# Altium project 3xAY_plus_RAM.PrjPCB
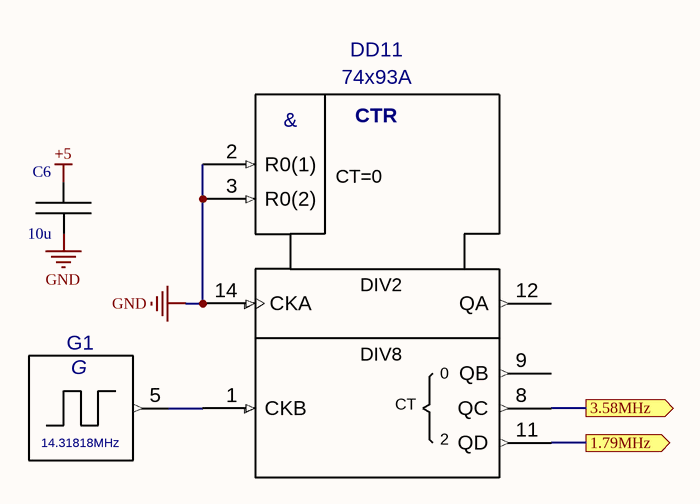
[diagram p0: oscillator.SchDoc]
7 sheets, 108 parts. Net scope: hierarchical (ports join the sheet entries above them; power ports are global).
Board file: main_board.PcbDoc
Sheets:
  oscillator.SchDoc
  main.SchDoc
    AY1 = ay.SchDoc
    AY2 = ay.SchDoc
    AY3 = ay.SchDoc
    Audio Mixer = mixer.SchDoc
    System Bus = system_bus.SchDoc
    Address Detector = address_detector.SchDoc
    Future Connector = future_connector.SchDoc

## Sheet oscillator.SchDoc
size A4

### Parts
(Parts that share a designator on the sheet are numbered #1, #2 ... from top to bottom, then left to right.)
C6#1  10u  [CAP 5.5x3.15]
DD11#1  74x93A  [DIP14]
G1#1  Frequency: 14.31818MHz  [DIP8 CXO]  (hidden comment: CXO)

### Ports
1.79MHz (out), 3.58MHz (out)

### Nets
+5: C6#1.2 DD11#1.5(+5)
GND: C6#1.1 DD11#1.2(R0(1)) DD11#1.3(R0(2)) DD11#1.10(GND) DD11#1.14(CKA)
NetDD11#1_1: DD11#1.1(CKB) G1#1.5
NetDD11#1_8: DD11#1.8(QC) ; port 3.58MHz
NetDD11#1_11: DD11#1.11(QD) ; port 1.79MHz

Not connected (* = marked no-connect by the designer): DD11#1 4(N.C.) 6(N.C.) 7(N.C.) 9(QB) 12(QA) 13(N.C.); G1#1 1(N.C.) 4(GND) 8(+5)

### Notes on the sheet
- (in symbol 74x93A IEEE) CTR; &; CT=0; DIV2; DIV8; 0; CT
- (in symbol CXO) G

### Library data of the parts
C6#1 = Cap: Murata ceramic capacitor
DD11#1 = 74x93A IEEE: ИЕ5; Value: *

## Sheet main.SchDoc
size A4
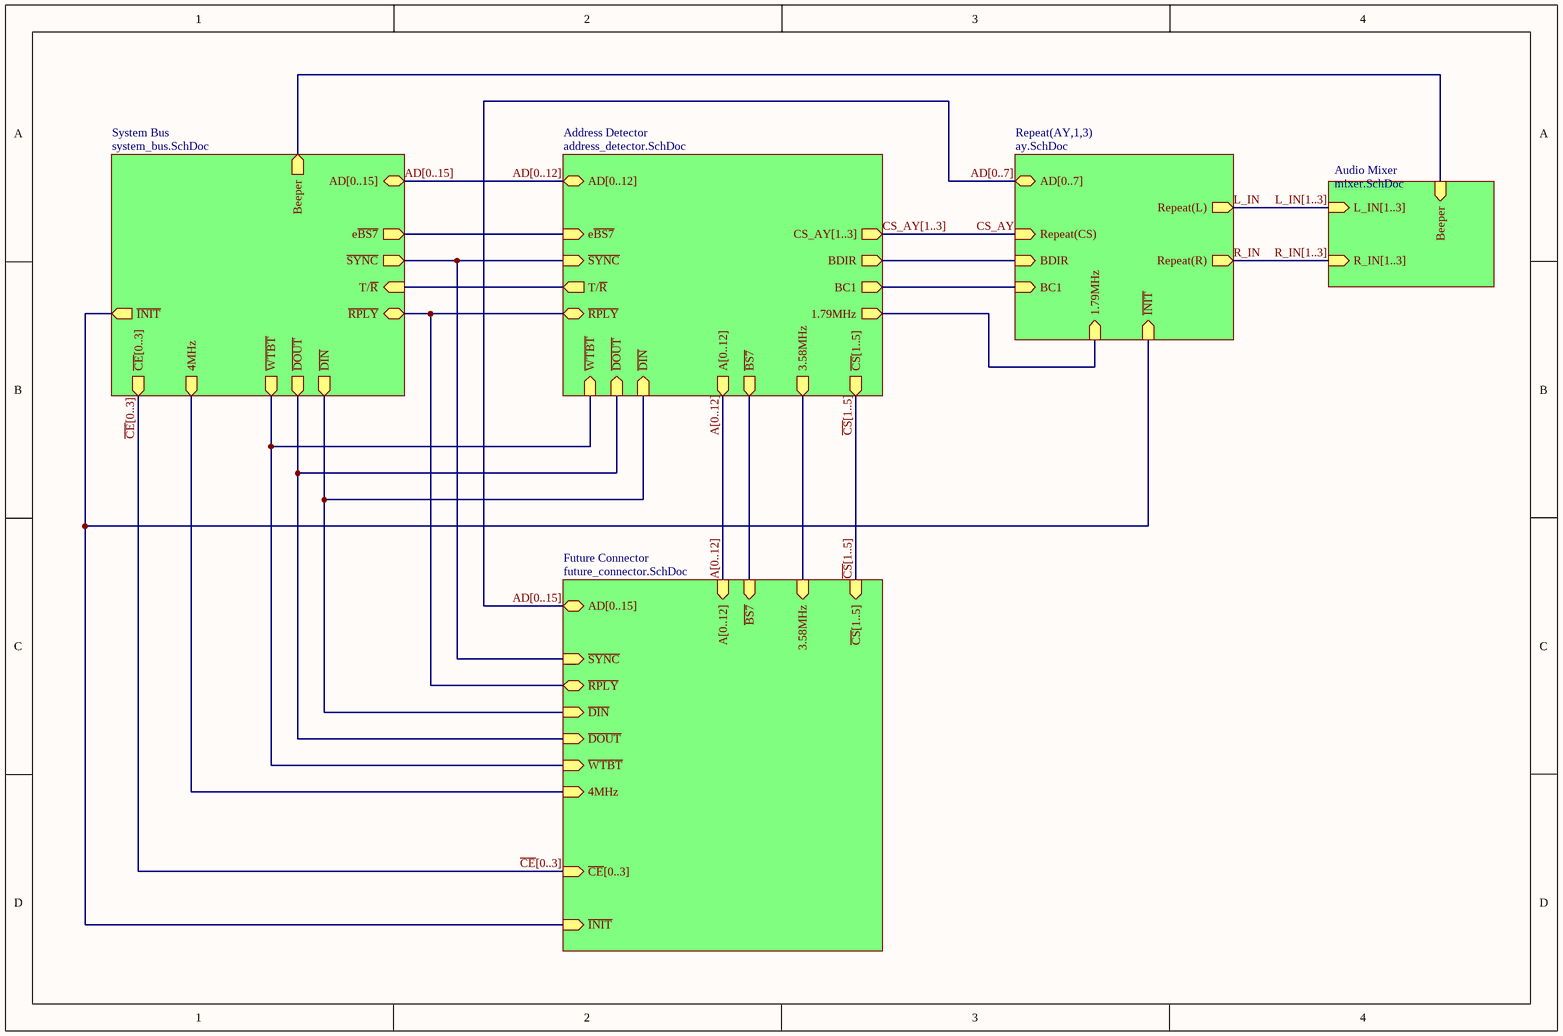
[diagram p1: main.SchDoc]

### Sub-sheets
Address Detector = address_detector.SchDoc: e~{BS7} (in), CS_AY[1..3] (out), AD[0..12] (bidir), ~{SYNC} (in), A[0..12] (out), ~{BS7} (out), ~{CS}[1..5] (out), ~{DOUT} (in), BDIR (out), ~{WTBT} (in), T/~{R} (out), BC1 (out), ~{DIN} (in), ~{RPLY} (bidir), 1.79MHz (out), 3.58MHz (out)
Audio Mixer = mixer.SchDoc: L_IN[1..3] (in), R_IN[1..3] (in), Beeper (in)
Future Connector = future_connector.SchDoc: AD[0..15] (bidir), A[0..12] (in), ~{CS}[1..5] (in), ~{BS7} (in), 3.58MHz (in), ~{DIN} (in), ~{WTBT} (in), ~{CE}[0..3] (in), ~{DOUT} (in), ~{INIT} (in), 4MHz (in), ~{SYNC} (in), ~{RPLY} (bidir)
Repeat(AY,1,3) = ay.SchDoc: Repeat(CS) (in), Repeat(L) (out), ~{INIT} (in), AD[0..7] (bidir), 1.79MHz (in), Repeat(R) (out), BC1 (in), BDIR (in)
System Bus = system_bus.SchDoc: AD[0..15] (bidir), e~{BS7} (out), ~{SYNC} (out), ~{DOUT} (out), ~{DIN} (out), ~{WTBT} (out), ~{INIT} (out), ~{CE}[0..3] (out), T/~{R} (in), ~{RPLY} (bidir), 4MHz (out), Beeper (out)

### Nets
3.58MHz: sheet Address Detector/3.58MHz, sheet Future Connector/3.58MHz
4MHz: sheet System Bus/4MHz, sheet Future Connector/4MHz
~{BS7}: sheet Address Detector/~{BS7}, sheet Future Connector/~{BS7}
BC1: sheet Repeat(AY,1,3)/BC1, sheet Address Detector/BC1
BDIR: sheet Repeat(AY,1,3)/BDIR, sheet Address Detector/BDIR
Beeper: sheet Audio Mixer/Beeper, sheet System Bus/Beeper
CLK: sheet Repeat(AY,1,3)/1.79MHz, sheet Address Detector/1.79MHz
CS_AY: sheet Repeat(AY,1,3)/Repeat(CS)
~{DIN}: sheet System Bus/~{DIN}, sheet Address Detector/~{DIN}, sheet Future Connector/~{DIN}
~{DOUT}: sheet System Bus/~{DOUT}, sheet Address Detector/~{DOUT}, sheet Future Connector/~{DOUT}
e~{BS7}: sheet System Bus/e~{BS7}, sheet Address Detector/e~{BS7}
~{INIT}: sheet Repeat(AY,1,3)/~{INIT}, sheet System Bus/~{INIT}, sheet Future Connector/~{INIT}
L_IN: sheet Repeat(AY,1,3)/Repeat(L)
~{RPLY}: sheet System Bus/~{RPLY}, sheet Address Detector/~{RPLY}, sheet Future Connector/~{RPLY}
R_IN: sheet Repeat(AY,1,3)/Repeat(R)
~{SYNC}: sheet System Bus/~{SYNC}, sheet Address Detector/~{SYNC}, sheet Future Connector/~{SYNC}
T/~{R}: sheet System Bus/T/~{R}, sheet Address Detector/T/~{R}
~{WTBT}: sheet System Bus/~{WTBT}, sheet Address Detector/~{WTBT}, sheet Future Connector/~{WTBT}

### Buses and harness runs
bus A[0..12]
bus A[0..12] = sheet Address Detector/A[0..12] = sheet Future Connector/A[0..12]
bus AD[0..7] = AD[0..12] = AD[0..15] = sheet Address Detector/AD[0..12] = sheet Future Connector/AD[0..15] = sheet Repeat(AY,1,3)/AD[0..7] = sheet System Bus/AD[0..15]
bus CS_AY[1..3] = sheet Address Detector/CS_AY[1..3]
bus L_IN[1..3] = sheet Audio Mixer/L_IN[1..3]
bus R_IN[1..3] = sheet Audio Mixer/R_IN[1..3]
bus ~{CE}[0..3] = sheet Future Connector/~{CE}[0..3] = sheet System Bus/~{CE}[0..3]
bus ~{CS}[1..5]
bus ~{CS}[1..5] = sheet Address Detector/~{CS}[1..5] = sheet Future Connector/~{CS}[1..5]

### Notes on the sheet
- Labels drawn without touching a wire or pin: A[0..12], ~{CS}[1..5]

## Sheet ay.SchDoc: AY-3-8913
size A4
Used 3 times, as channels AY1, AY2, AY3. Parts and nets are listed once, with the designators drawn on the sheet.
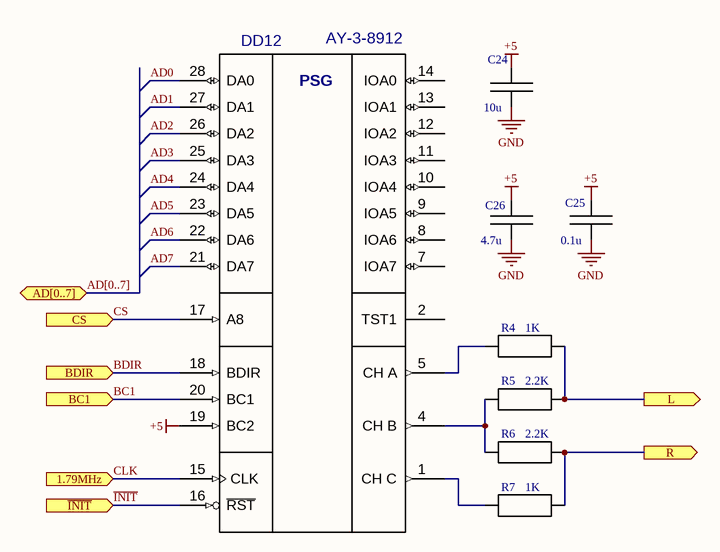
[diagram p2: ay.SchDoc]

### Parts
C24  10u  [CAP 5.5x3.15]
C25  0.1u  [CAP 4x2.5]
C26  4.7u  [CAP 5.5x3.15]
DD12  AY-3-8912  [DIP28]
R4  1K  [Axial Res 0.25]
R5  2.2K  [Axial Res 0.25]
R6  2.2K  [Axial Res 0.25]
R7  1K  [Axial Res 0.25]

### Ports
1.79MHz (in), AD[0..7] (bidir), BC1 (in), BDIR (in), CS (in), L (out), R (out), ~{INIT} (in)

### Nets
+5: C24.2 C25.2 C26.2 DD12.3(Vcc) DD12.19(BC2)
GND: C24.1 C25.1 C26.1 DD12.6(Vss)
AD0: DD12.28(DA0)
AD1: DD12.27(DA1)
AD2: DD12.26(DA2)
AD3: DD12.25(DA3)
AD4: DD12.24(DA4)
AD5: DD12.23(DA5)
AD6: DD12.22(DA6)
AD7: DD12.21(DA7)
BC1: DD12.20(BC1) ; port BC1
BDIR: DD12.18(BDIR) ; port BDIR
CLK: DD12.15(CLK) ; port 1.79MHz
CS: DD12.17(A8) ; port CS
~{INIT}: DD12.16(~{RST}) ; port ~{INIT}
L: R4.1 R5.1 ; port L
R: R6.1 R7.1 ; port R
NetDD12_1: DD12.1(CH_C) R7.2
NetDD12_4: DD12.4(CH_B) R5.2 R6.2
NetDD12_5: DD12.5(CH_A) R4.2

Not connected (* = marked no-connect by the designer): DD12 2(TST1) 7(IOA7) 8(IOA6) 9(IOA5) 10(IOA4) 11(IOA3) 12(IOA2) 13(IOA1) 14(IOA0)

### Channels
AY1: designators end in _AY1; ports 1.79MHz=CLK BC1=BC1 BDIR=BDIR CS=CS L=L_IN1 R=R_IN1 ~{INIT}=~{INIT}
AY2: designators end in _AY2; ports 1.79MHz=CLK BC1=BC1 BDIR=BDIR CS=CS L=L_IN1 R=R_IN1 ~{INIT}=~{INIT}
AY3: designators end in _AY3; ports 1.79MHz=CLK BC1=BC1 BDIR=BDIR CS=CS L=L_IN1 R=R_IN1 ~{INIT}=~{INIT}

### Buses and harness runs
bus AD[0..7] = port AD[0..7]

### Notes on the sheet
- (in symbol AY-3-8912) PSG

### Library data of the parts
C24-C26 = Cap: Murata ceramic capacitor
R4-R7 = Axial Resistor 0.25
DD12 = AY-3-8912: Value: *

## Sheet mixer.SchDoc
size A4
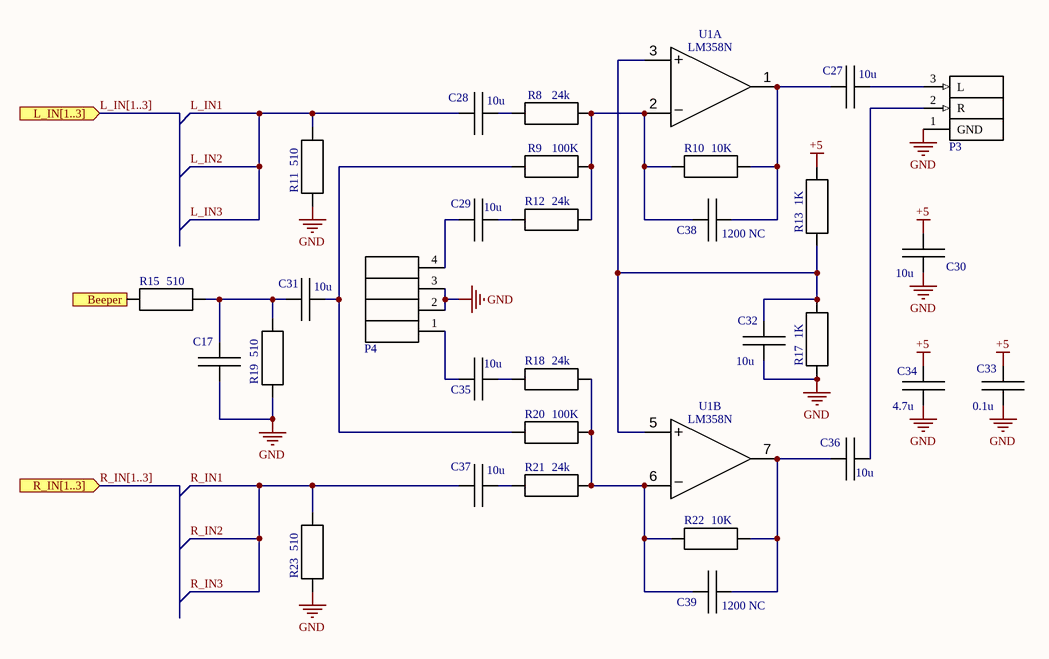
[diagram p3: mixer.SchDoc]

### Parts
C17  Cap  [CAP 4x2.5]  (value not drawn)
C27  10u  [CAP 5.5x3.15]
C28  10u  [CAP 5.5x3.15]
C29  10u  [CAP 5.5x3.15]
C30  10u  [CAP 5.5x3.15]
C31  10u  [CAP 5.5x3.15]
C32  10u  [CAP 5.5x3.15]
C33  0.1u  [CAP 4x2.5]
C34  4.7u  [CAP 5.5x3.15]
C35  10u  [CAP 5.5x3.15]
C36  10u  [CAP 5.5x3.15]
C37  10u  [CAP 5.5x3.15]
C38  1200 NC  [CAP 5.5x3.15]
C39  1200 NC  [CAP 5.5x3.15]
P3  3.5mm audio socket  [ST-111]  (value not drawn)
P4  Header 4  [PLS4]  (value not drawn)
R8  24k  [Axial Res 0.25]
R9  100K  [Axial Res 0.25]
R10  10K  [Axial Res 0.25]
R11  510  [Axial Res 0.25]
R12  24k  [Axial Res 0.25]
R13  1K  [Axial Res 0.25]
R15  510  [Axial Res 0.25]
R17  1K  [Axial Res 0.25]
R18  24k  [Axial Res 0.25]
R19  510  [Axial Res 0.25]
R20  100K  [Axial Res 0.25]
R21  24k  [Axial Res 0.25]
R22  10K  [Axial Res 0.25]
R23  510  [Axial Res 0.25]
U1  LM358N  [DIP8]  (parts A,B of 2)

### Ports
Beeper (in), L_IN[1..3] (in), R_IN[1..3] (in)

### Nets
+5: C30.2 C33.2 C34.2 R13.1 U1.8(V+)
GND: C17.1 C30.1 C32.1 C33.1 C34.1 P3.1(GND) P4.2 P4.3 R11.2 R17.2 R19.2 R23.2 U1.4(GND)
Beeper: R15.2 ; port Beeper
L_IN1: C28.1 R11.1  [also labelled L_IN2, L_IN3]
R_IN1: C37.1 R23.1  [also labelled R_IN2, R_IN3]
NetC17_2: C17.2 C31.1 R15.1 R19.1
NetC27_1: C27.1 C38.1 R10.1 U1.1(Aout)
NetC27_2: C27.2 P3.3(L)
NetC28_2: C28.2 R8.2
NetC29_1: C29.1 P4.4
NetC29_2: C29.2 R12.2
NetC31_2: C31.2 R9.2 R20.2
NetC32_2: C32.2 R13.2 R17.1 U1.3(A+) U1.5(B+)
NetC35_1: C35.1 P4.1
NetC35_2: C35.2 R18.2
NetC36_1: C36.1 C39.1 R22.1 U1.7(Bout)
NetC36_2: C36.2 P3.2(R)
NetC37_2: C37.2 R21.2
NetC38_2: C38.2 R8.1 R9.1 R10.2 R12.1 U1.2(A-)
NetC39_2: C39.2 R18.1 R20.1 R21.1 R22.2 U1.6(B-)

### Buses and harness runs
bus L_IN[1..3] = port L_IN[1..3]
bus R_IN[1..3] = port R_IN[1..3]

### Notes on the sheet
- (in symbol LM358N, part A) +; −
- (in symbol LM358N, part B) +; −

### Library data of the parts
C17 C27-C39 = Cap: Murata ceramic capacitor
P4 = PLS4
R8-R13 R15 R17-R23 = Axial Resistor 0.25

## Sheet system_bus.SchDoc
size A4
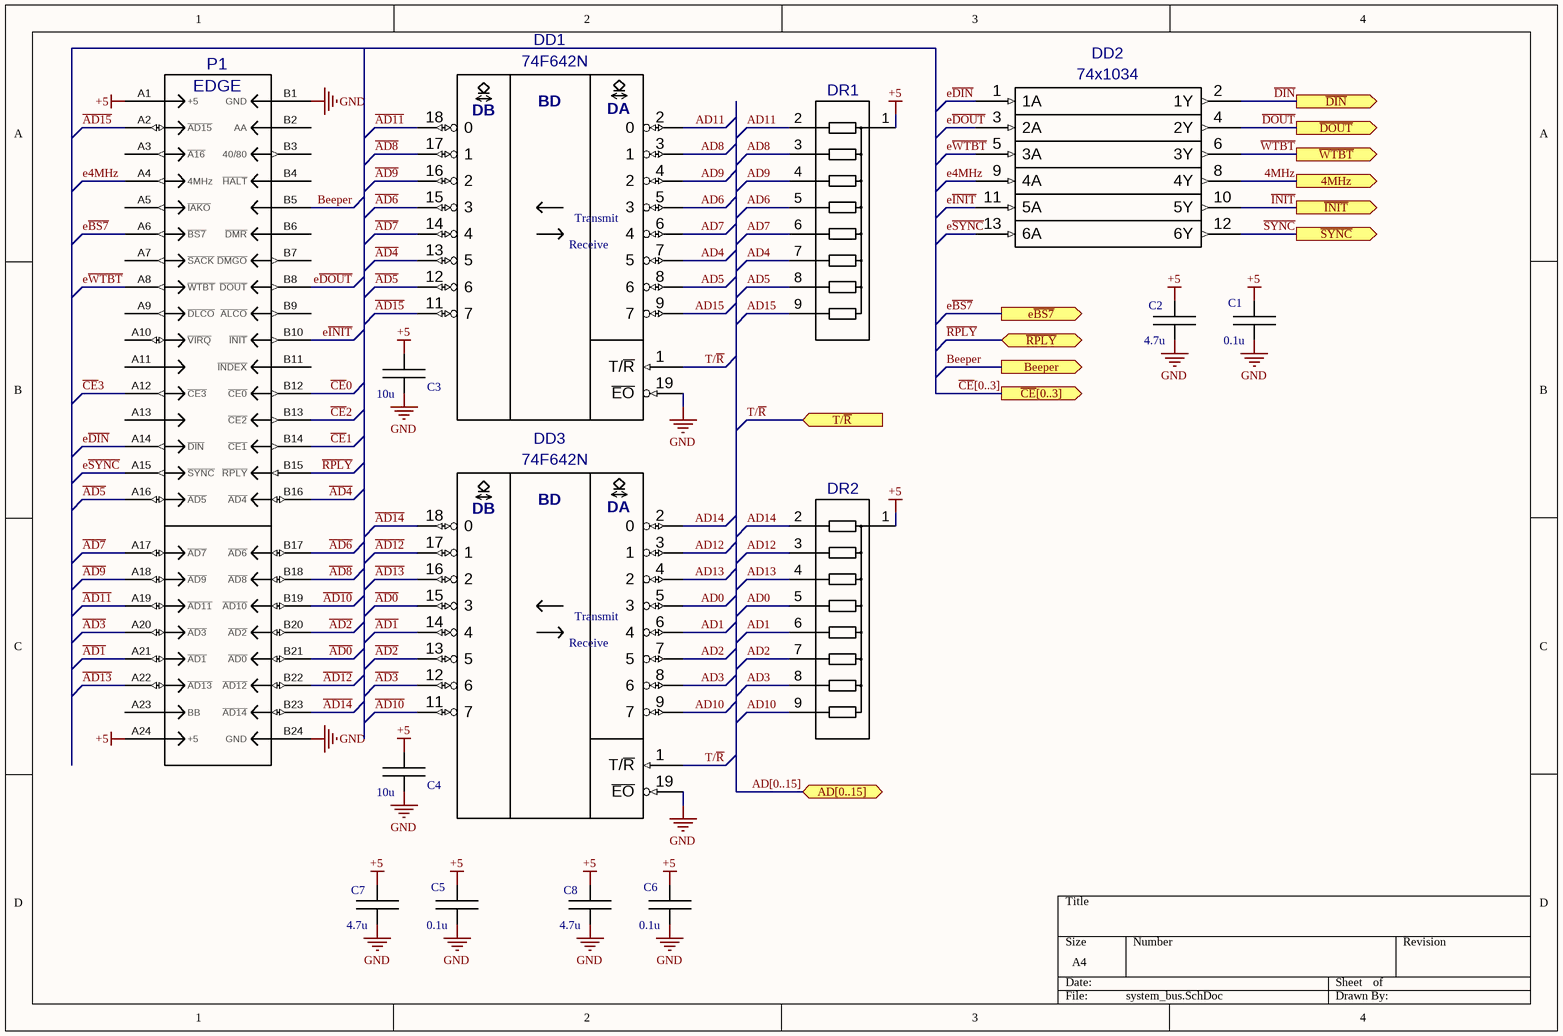
[diagram p4: system_bus.SchDoc]

### Parts
(Parts that share a designator on the sheet are numbered #1, #2 ... from top to bottom, then left to right.)
C1  0.1u  [CAP 4x2.5]
C2  4.7u  [CAP 5.5x3.15]
C3  10u  [CAP 5.5x3.15]
C4  10u  [CAP 5.5x3.15]
C5  0.1u  [CAP 4x2.5]
C6#2  0.1u  [CAP 4x2.5]
C7  4.7u  [CAP 5.5x3.15]
C8  4.7u  [CAP 5.5x3.15]
DD1  74F642N  [DIP20]
DD2  74x1034  [DIP14]
DD3  74F642N  [DIP20]
DR1  RNA8  [SIP9]  (value not drawn)
DR2  RNA8  [SIP9]  (value not drawn)
P1  EDGE  [SNP15-48 EDGE]

### Ports
4MHz (out), AD[0..15] (bidir), Beeper (out), e~{BS7} (out), T/~{R} (in), ~{CE}[0..3] (out), ~{DIN} (out), ~{DOUT} (out), ~{INIT} (out), ~{RPLY} (bidir), ~{SYNC} (out), ~{WTBT} (out)

### Nets
+5: C1.2 C2.2 C3.2 C4.2 C5.2 C6#2.2 C7.2 C8.2 DD1.20(Vcc) DD2.14(+5) DD3.20(Vcc) DR1.1 DR2.1 P1.A1(+5) P1.A24(+5)
GND: C1.1 C2.1 C3.1 C4.1 C5.1 C6#2.1 C7.1 C8.1 DD1.10(GND) DD1.19(~{EO}) DD2.7(GND) DD3.10(GND) DD3.19(~{EO}) P1.B1(GND) P1.B24(GND)
4MHz: DD2.8(4Y) ; port 4MHz
~{AD0}: DD3.15(3) P1.B21(~{AD0})
~{AD1}: DD3.14(4) P1.A21(~{AD1})
~{AD10}: DD3.11(7) P1.B19(~{AD10})
~{AD11}: DD1.18(0) P1.A19(~{AD11})
~{AD12}: DD3.17(1) P1.B22(~{AD12})
~{AD13}: DD3.16(2) P1.A22(~{AD13})
~{AD14}: DD3.18(0) P1.B23(~{AD14})
~{AD15}: DD1.11(7) P1.A2(~{AD15})
~{AD2}: DD3.13(5) P1.B20(~{AD2})
~{AD3}: DD3.12(6) P1.A20(~{AD3})
~{AD4}: DD1.13(5) P1.B16(~{AD4})
~{AD5}: DD1.12(6) P1.A16(~{AD5})
~{AD6}: DD1.15(3) P1.B17(~{AD6})
~{AD7}: DD1.14(4) P1.A17(~{AD7})
~{AD8}: DD1.17(1) P1.B18(~{AD8})
~{AD9}: DD1.16(2) P1.A18(~{AD9})
AD0: DD3.5(3) DR2.5
AD1: DD3.6(4) DR2.6
AD2: DD3.7(5) DR2.7
AD3: DD3.8(6) DR2.8
AD4: DD1.7(5) DR1.7
AD5: DD1.8(6) DR1.8
AD6: DD1.5(3) DR1.5
AD7: DD1.6(4) DR1.6
AD8: DD1.3(1) DR1.3
AD9: DD1.4(2) DR1.4
AD10: DD3.9(7) DR2.9
AD11: DD1.2(0) DR1.2
AD12: DD3.3(1) DR2.3
AD13: DD3.4(2) DR2.4
AD14: DD3.2(0) DR2.2
AD15: DD1.9(7) DR1.9
Beeper: P1.B5 ; port Beeper
~{CE}0: P1.B12(~{CE0})
~{CE}1: P1.B14(~{CE1})
~{CE}2: P1.B13(~{CE2})
~{CE}3: P1.A12(~{CE3})
~{DIN}: DD2.2(1Y) ; port ~{DIN}
~{DOUT}: DD2.4(2Y) ; port ~{DOUT}
e4MHz: DD2.9(4A) P1.A4(4MHz)
e~{BS7}: P1.A6(~{BS7}) ; port e~{BS7}
e~{DIN}: DD2.1(1A) P1.A14(~{DIN})
e~{DOUT}: DD2.3(2A) P1.B8(~{DOUT})
e~{INIT}: DD2.11(5A) P1.B10(~{INIT})
e~{SYNC}: DD2.13(6A) P1.A15(~{SYNC})
e~{WTBT}: DD2.5(3A) P1.A8(~{WTBT})
~{INIT}: DD2.10(5Y) ; port ~{INIT}
~{RPLY}: P1.B15(~{RPLY}) ; port ~{RPLY}
~{SYNC}: DD2.12(6Y) ; port ~{SYNC}
T/~{R}: DD1.1(T/~{R}) DD3.1(T/~{R}) ; port T/~{R}
~{WTBT}: DD2.6(3Y) ; port ~{WTBT}

Not connected (* = marked no-connect by the designer): P1 A3(~{A16}) A5(~{IAKO}) A7(~{SACK}) A9(~{DLCO}) A10(~{VIRQ}) A11 A13 A23(BB) B2(AA) B3(40/80) B4(~{HALT}) B6(~{DMR}) B7(~{DMGO}) B9(~{ALCO}) B11(~{INDEX})

### Buses and harness runs
bus AD[0..15] = port AD[0..15]
bus ~{CE}[0..3] = port ~{CE}[0..3]

### Notes on the sheet
- (in symbol 74x642) BD; DA; DB; Transmit; Receive

### Library data of the parts
C1-C5 C6#2 C7 C8 = Cap: Murata ceramic capacitor
DD1 DD3 = 74x642: Value: *
DD2 = 74x1034 IEEE: ЛП19 6 buffers; Value: *
P1 = SNP15-48 EDGE: Value: *

## Sheet address_detector.SchDoc
size A3
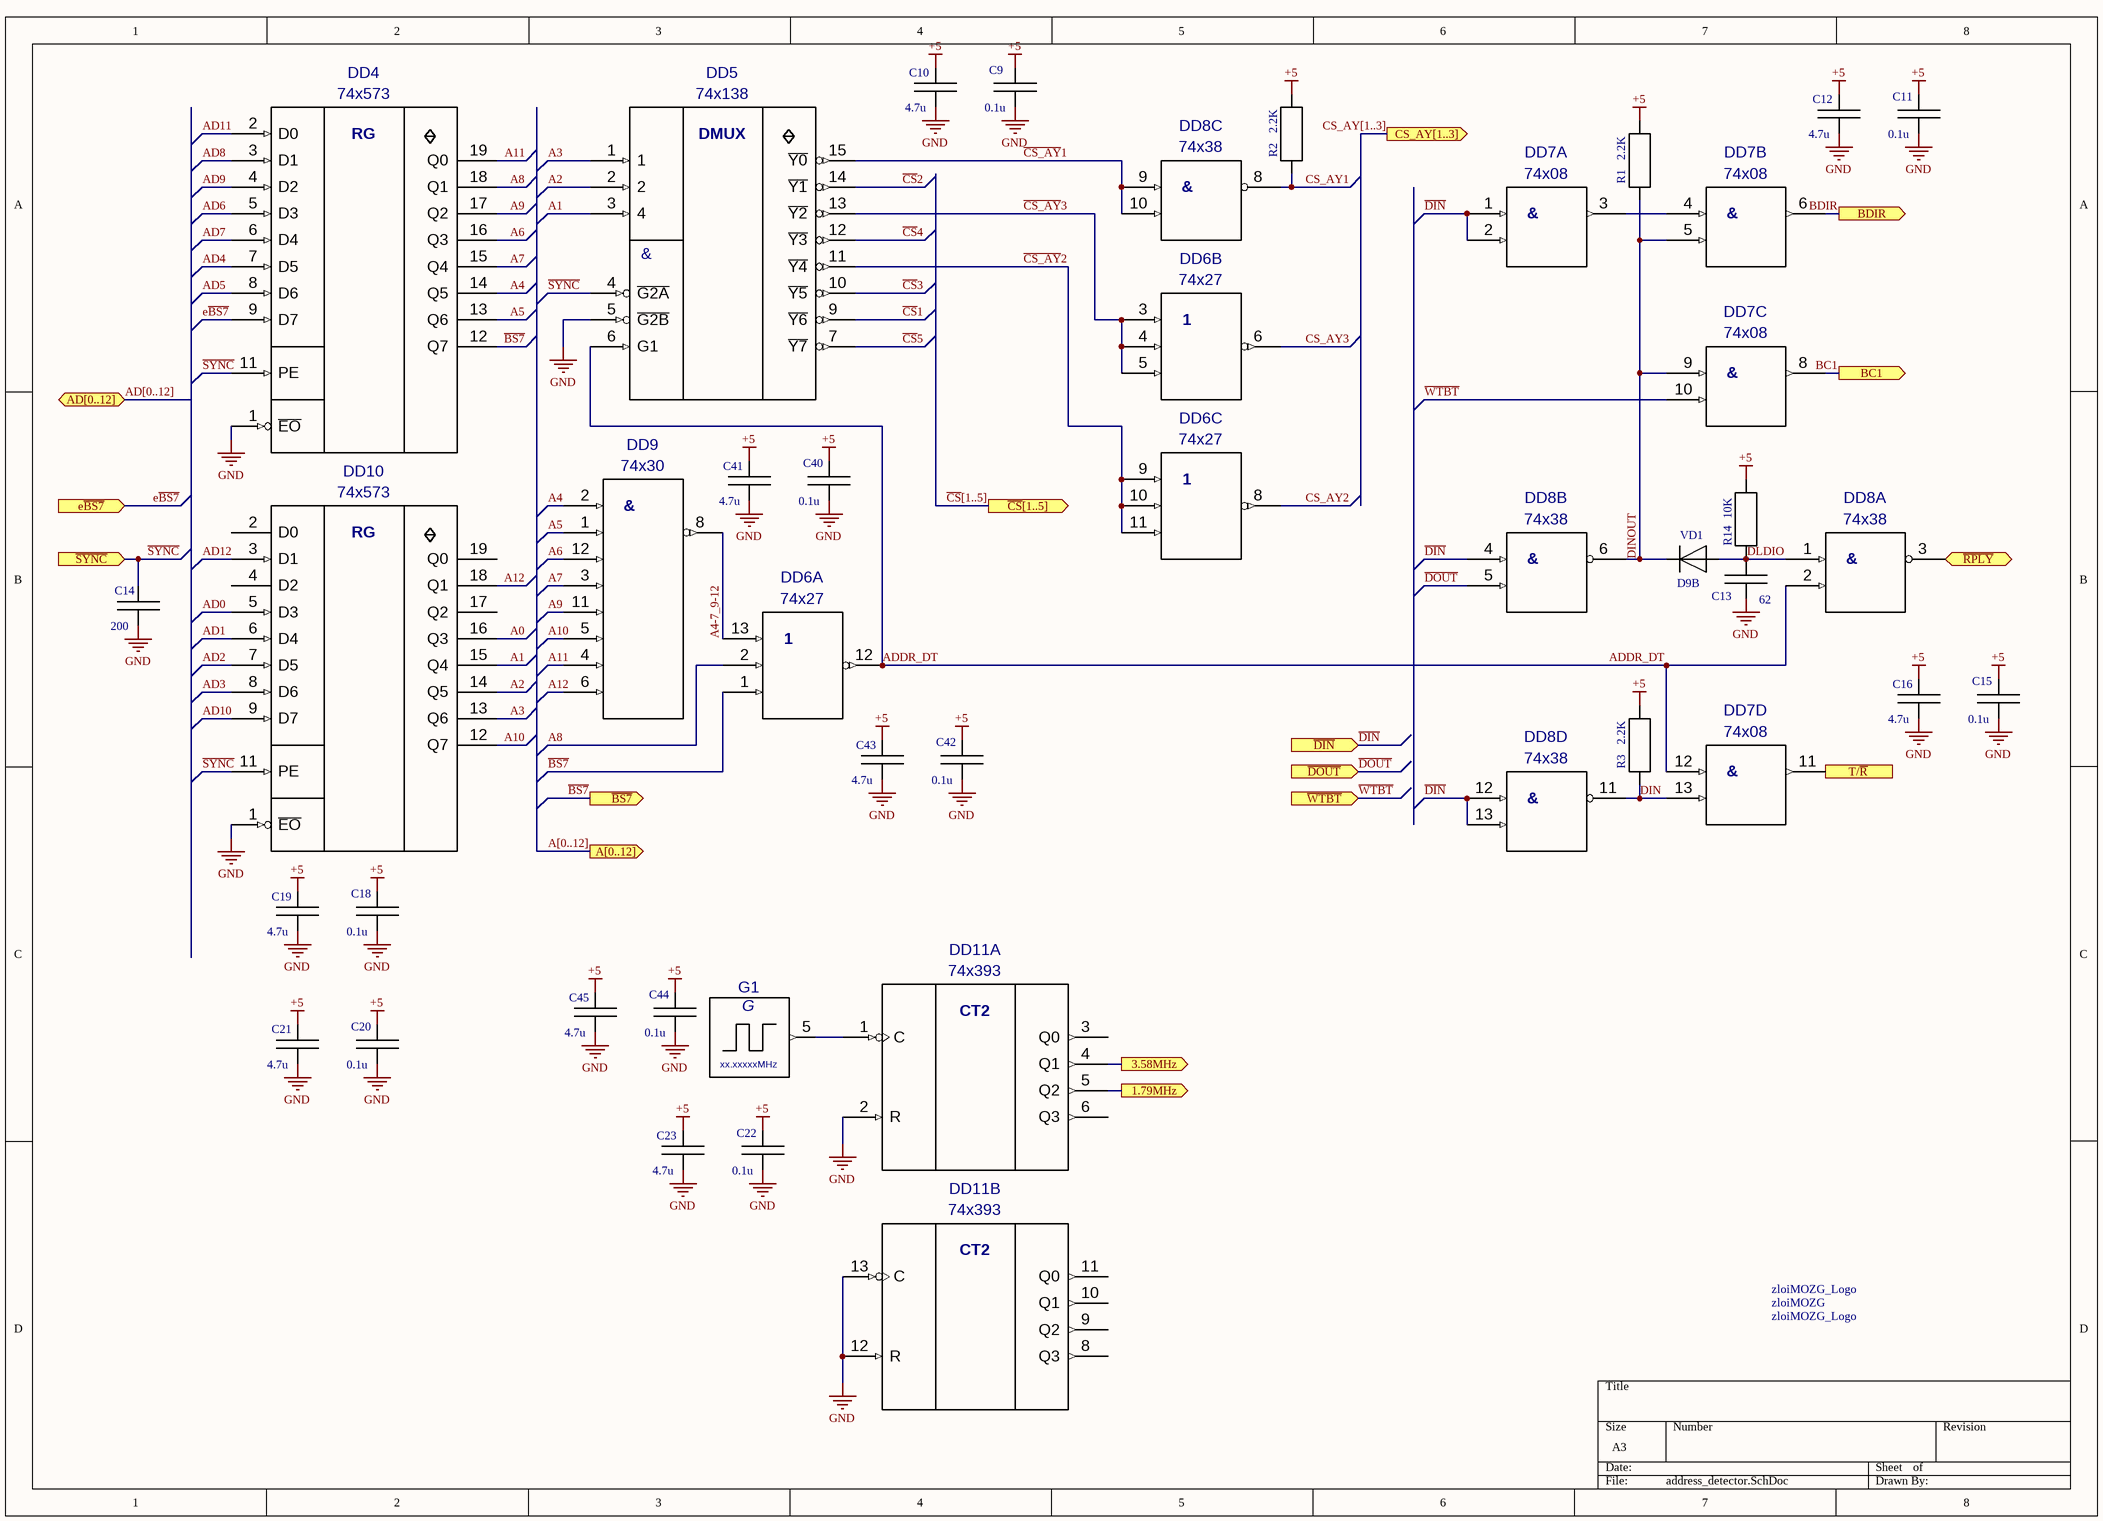
[diagram p5: address_detector.SchDoc]

### Parts
(Parts that share a designator on the sheet are numbered #1, #2 ... from top to bottom, then left to right.)
C9  0.1u  [CAP 4x2.5]
C10  4.7u  [CAP 5.5x3.15]
C11  0.1u  [CAP 4x2.5]
C12  4.7u  [CAP 5.5x3.15]
C13  62  [CAP 4x2.5]
C14  200  [CAP 4x2.5]
C15  0.1u  [CAP 4x2.5]
C16  4.7u  [CAP 5.5x3.15]
C18  0.1u  [CAP 4x2.5]
C19  4.7u  [CAP 5.5x3.15]
C20  0.1u  [CAP 4x2.5]
C21  4.7u  [CAP 5.5x3.15]
C22  0.1u  [CAP 4x2.5]
C23  4.7u  [CAP 5.5x3.15]
C40  0.1u  [CAP 4x2.5]
C41  4.7u  [CAP 5.5x3.15]
C42  0.1u  [CAP 4x2.5]
C43  4.7u  [CAP 5.5x3.15]
C44  0.1u  [CAP 4x2.5]
C45  4.7u  [CAP 5.5x3.15]
DD4  74x573  [DIP20]
DD5  74x138  [DIP16]
DD6  74x27  [DIP14]  (parts A,B,C of 3)
DD7  74x08  [DIP14]  (parts A,B,C,D of 4)
DD8  74x38  [DIP14]  (parts A,B,C,D of 4)
DD9  74x30  [DIP14]
DD10  74x573  [DIP20]
DD11#2  74x393  [DIP14]  (parts A,B of 2)
G1#2  Frequency: xx.xxxxxMHz  [DIP8 CXO]  (hidden comment: CXO)
R1  2.2K  [Axial Res 0.25]
R2  2.2K  [Axial Res 0.25]
R3  2.2K  [Axial Res 0.25]
R14  10K  [Axial Res 0.25]
VD1  D9B  [D9]
zloiMOZG_Logo  zloiMOZG_Logo  [zloiMOZG_Logo_1.5mm]

### Ports
1.79MHz (out), 3.58MHz (out), A[0..12] (out), AD[0..12] (bidir), BC1 (out), BDIR (out), CS_AY[1..3] (out), e~{BS7} (in), T/~{R} (out), ~{BS7} (out), ~{CS}[1..5] (out), ~{DIN} (in), ~{DOUT} (in), ~{RPLY} (bidir), ~{SYNC} (in), ~{WTBT} (in)

### Nets
+5: C9.2 C10.2 C11.2 C12.2 C15.2 C16.2 C18.2 C19.2 C20.2 C21.2 C22.2 C23.2 C40.2 C41.2 C42.2 C43.2 C44.2 C45.2 DD4.20(+5V) DD5.16(+5) DD6.14(+5V) DD7.14(+5V) DD8.14(+5) DD9.14(+5) DD10.20(+5V) DD11#2.14(+5) G1#2.8(+5) R1.1 R2.1 R3.1 R14.1
GND: C9.1 C10.1 C11.1 C12.1 C13.1 C14.1 C15.1 C16.1 C18.1 C19.1 C20.1 C21.1 C22.1 C23.1 C40.1 C41.1 C42.1 C43.1 C44.1 C45.1 DD4.1(~{EO}) DD4.10(GND) DD5.5(~{G2B}) DD5.8(GND) DD6.7(GND) DD7.7(GND) DD8.7(GND) DD9.7(GND) DD10.1(~{EO}) DD10.10(GND) DD11#2.2(R) DD11#2.7(GND) DD11#2.12(R) DD11#2.13(С) G1#2.4(GND)
3.58MHz: DD11#2.4(Q1) ; port 3.58MHz
A0: DD10.16(Q3)
A1: DD5.3(4) DD10.15(Q4)
A2: DD5.2 DD10.14(Q5)
A3: DD5.1 DD10.13(Q6)
A4: DD4.14(Q5) DD9.2
A4-7_9-12: DD6.13 DD9.8
A5: DD4.13(Q6) DD9.1
A6: DD4.16(Q3) DD9.12
A7: DD4.15(Q4) DD9.3
A8: DD4.18(Q1) DD6.2
A9: DD4.17(Q2) DD9.11
A10: DD9.5 DD10.12(Q7)
A11: DD4.19(Q0) DD9.4
A12: DD9.6 DD10.18(Q1)
AD0: DD10.5(D3)
AD1: DD10.6(D4)
AD2: DD10.7(D5)
AD3: DD10.8(D6)
AD4: DD4.7(D5)
AD5: DD4.8(D6)
AD6: DD4.5(D3)
AD7: DD4.6(D4)
AD8: DD4.3(D1)
AD9: DD4.4(D2)
AD10: DD10.9(D7)
AD11: DD4.2(D0)
AD12: DD10.3(D1)
ADDR_DT: DD5.6(G1) DD6.12 DD7.12 DD8.2
~{BS7}: DD4.12(Q7) DD6.1 ; port ~{BS7}
BC1: DD7.8 ; port BC1
BDIR: DD7.6 ; port BDIR
~{CS}1: DD5.9(~{Y6})
~{CS}2: DD5.14(~{Y1})
~{CS}3: DD5.10(~{Y5})
~{CS}4: DD5.12(~{Y3})
~{CS}5: DD5.7(~{Y7})
~{CS_AY}1: DD5.15(~{Y0}) DD8.9 DD8.10
~{CS_AY}2: DD5.11(~{Y4}) DD6.9 DD6.10 DD6.11
~{CS_AY}3: DD5.13(~{Y2}) DD6.3 DD6.4 DD6.5
CLK: DD11#2.5(Q2) ; port 1.79MHz
CS_AY1: DD8.8 R2.2  [project net CS]
CS_AY2: DD6.8  [project net CS]
CS_AY3: DD6.6  [project net CS]
~{DIN}: DD7.1 DD7.2 DD8.4 DD8.12 DD8.13 ; port ~{DIN}
~{DOUT}: DD8.5 ; port ~{DOUT}
DIN: DD7.13 DD8.11 R3.2
DINOUT: DD7.5 DD7.9 DD8.6 R1.2 VD1.2
DLDIO: C13.2 DD8.1 R14.2 VD1.1
e~{BS7}: DD4.9(D7) ; port e~{BS7}
~{RPLY}: DD8.3 ; port ~{RPLY}
~{SYNC}: C14.2 DD4.11(PE) DD5.4(~{G2A}) DD10.11(PE) ; port ~{SYNC}
T/~{R}: DD7.11 ; port T/~{R}
~{WTBT}: DD7.10 ; port ~{WTBT}
NetDD7_3: DD7.3 DD7.4
NetDD11#2_1: DD11#2.1(С) G1#2.5

Not connected (* = marked no-connect by the designer): DD10 2(D0) 4(D2) 17(Q2) 19(Q0); DD11#2 3(Q0) 6(Q3) 8(Q3) 9(Q2) 10(Q1) 11(Q0); G1#2 1(N.C.)

### Buses and harness runs
bus A[0..12] = port A[0..12]
bus AD[0..12] = port AD[0..12]
bus CS_AY[1..3] = port CS_AY[1..3]
bus ~{CS}[1..5] = port ~{CS}[1..5]

### Notes on the sheet
- (in symbol 74x08, part A) &
- (in symbol 74x08, part B) &
- (in symbol 74x08, part C) &
- (in symbol 74x08, part D) &
- (in symbol 74x30) &
- (in symbol 74x38, part A) &
- (in symbol 74x38, part B) &
- (in symbol 74x38, part C) &
- (in symbol 74x38, part D) &
- (in symbol 74x138) DMUX; &
- (in symbol 74x393, part A) CT2
- (in symbol 74x393, part B) CT2
- (in symbol 74x573) RG
- (in symbol CXO) G
- (in symbol zloiMOZG_Logo) zloiMOZG

### Library data of the parts
C9-C16 C18-C23 C40-C45 = Cap: Murata ceramic capacitor
DD4 DD10 = 74x573: ИР22 transparent latch; Value: *
DD5 = 74x138: ИД7 3 to 8 DEMUX; Value: *
DD6 = 74x27: ЛЕ4 3x3NOR; Value: *
DD7 = 74x08: ЛИ1 4x2AND; Value: *
DD8 = 74x38: ЛА13 4x2NAND O.C.; Value: *
DD9 = 74x30: ЛА2 8NAND; Value: *
DD11#2 = 74x393: ИЕ19; Value: *
R1-R3 R14 = Axial Resistor 0.25
VD1 = Diode

## Sheet future_connector.SchDoc
size A4
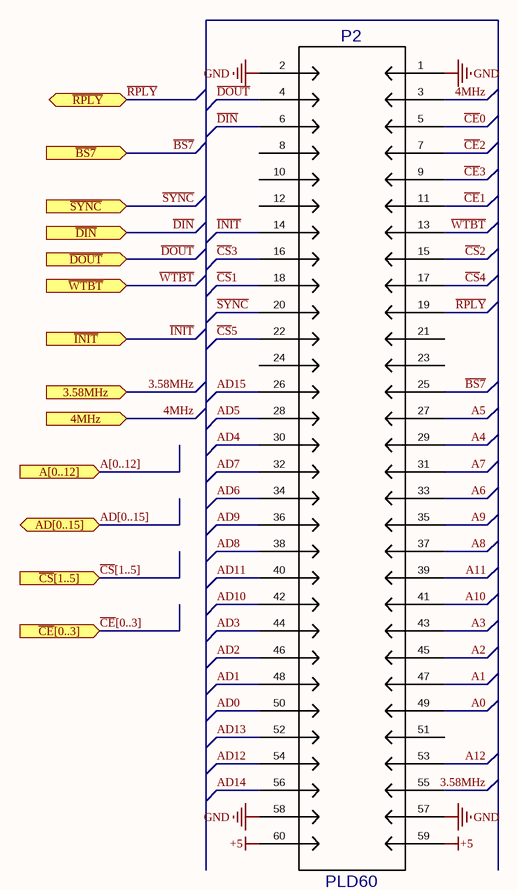
[diagram p6: future_connector.SchDoc]

### Parts
P2  PLD60  [PLD60]

### Ports
3.58MHz (in), 4MHz (in), A[0..12] (in), AD[0..15] (bidir), ~{BS7} (in), ~{CE}[0..3] (in), ~{CS}[1..5] (in), ~{DIN} (in), ~{DOUT} (in), ~{INIT} (in), ~{RPLY} (bidir), ~{SYNC} (in), ~{WTBT} (in)

### Nets
+5: P2.59 P2.60
GND: P2.1 P2.2 P2.57 P2.58
3.58MHz: P2.55 ; port 3.58MHz
4MHz: P2.3 ; port 4MHz
A0: P2.49
A1: P2.47
A2: P2.45
A3: P2.43
A4: P2.29
A5: P2.27
A6: P2.33
A7: P2.31
A8: P2.37
A9: P2.35
A10: P2.41
A11: P2.39
A12: P2.53
AD0: P2.50
AD1: P2.48
AD2: P2.46
AD3: P2.44
AD4: P2.30
AD5: P2.28
AD6: P2.34
AD7: P2.32
AD8: P2.38
AD9: P2.36
AD10: P2.42
AD11: P2.40
AD12: P2.54
AD13: P2.52
AD14: P2.56
AD15: P2.26
~{BS7}: P2.25 ; port ~{BS7}
~{CE}0: P2.5
~{CE}1: P2.11
~{CE}2: P2.7
~{CE}3: P2.9
~{CS}1: P2.18
~{CS}2: P2.15
~{CS}3: P2.16
~{CS}4: P2.17
~{CS}5: P2.22
~{DIN}: P2.6 ; port ~{DIN}
~{DOUT}: P2.4 ; port ~{DOUT}
~{INIT}: P2.14 ; port ~{INIT}
~{RPLY}: P2.19 ; port ~{RPLY}
~{SYNC}: P2.20 ; port ~{SYNC}
~{WTBT}: P2.13 ; port ~{WTBT}

Not connected (* = marked no-connect by the designer): P2 8 10 12 21 23 24 51

### Buses and harness runs
bus A[0..12] = port A[0..12]
bus AD[0..15] = port AD[0..15]
bus ~{CE}[0..3] = port ~{CE}[0..3]
bus ~{CS}[1..5] = port ~{CS}[1..5]

### Library data of the parts
P2 = PLD60: Value: *

## Nets that join several sheets
+5: oscillator (C6#1.2 DD11#1.5), AY1 (5 pins), AY2 (5 pins), AY3 (5 pins), mixer (5 pins), system_bus (15 pins), address_detector (31 pins), future_connector (P2.59 P2.60)
GND: oscillator (5 pins), AY1 (C24_AY1.1 C25_AY1.1 C26_AY1.1 DD12_AY1.6), AY2 (C24_AY2.1 C25_AY2.1 C26_AY2.1 DD12_AY2.6), AY3 (C24_AY3.1 C25_AY3.1 C26_AY3.1 DD12_AY3.6), mixer (13 pins), system_bus (15 pins), address_detector (35 pins), future_connector (P2.1 P2.2 P2.57 P2.58)
3.58MHz: address_detector (DD11#2.4), future_connector (P2.55)
4MHz: system_bus (DD2.8), future_connector (P2.3)
A0: address_detector (DD10.16), future_connector (P2.49)
A1: address_detector (DD5.3 DD10.15), future_connector (P2.47)
A2: address_detector (DD5.2 DD10.14), future_connector (P2.45)
A3: address_detector (DD5.1 DD10.13), future_connector (P2.43)
A4: address_detector (DD4.14 DD9.2), future_connector (P2.29)
A5: address_detector (DD4.13 DD9.1), future_connector (P2.27)
A6: address_detector (DD4.16 DD9.12), future_connector (P2.33)
A7: address_detector (DD4.15 DD9.3), future_connector (P2.31)
A8: address_detector (DD4.18 DD6.2), future_connector (P2.37)
A9: address_detector (DD4.17 DD9.11), future_connector (P2.35)
A10: address_detector (DD9.5 DD10.12), future_connector (P2.41)
A11: address_detector (DD4.19 DD9.4), future_connector (P2.39)
A12: address_detector (DD9.6 DD10.18), future_connector (P2.53)
AD0: AY1 (DD12_AY1.28), AY2 (DD12_AY2.28), AY3 (DD12_AY3.28), system_bus (DD3.5 DR2.5), address_detector (DD10.5), future_connector (P2.50)
AD1: AY1 (DD12_AY1.27), AY2 (DD12_AY2.27), AY3 (DD12_AY3.27), system_bus (DD3.6 DR2.6), address_detector (DD10.6), future_connector (P2.48)
AD2: AY1 (DD12_AY1.26), AY2 (DD12_AY2.26), AY3 (DD12_AY3.26), system_bus (DD3.7 DR2.7), address_detector (DD10.7), future_connector (P2.46)
AD3: AY1 (DD12_AY1.25), AY2 (DD12_AY2.25), AY3 (DD12_AY3.25), system_bus (DD3.8 DR2.8), address_detector (DD10.8), future_connector (P2.44)
AD4: AY1 (DD12_AY1.24), AY2 (DD12_AY2.24), AY3 (DD12_AY3.24), system_bus (DD1.7 DR1.7), address_detector (DD4.7), future_connector (P2.30)
AD5: AY1 (DD12_AY1.23), AY2 (DD12_AY2.23), AY3 (DD12_AY3.23), system_bus (DD1.8 DR1.8), address_detector (DD4.8), future_connector (P2.28)
AD6: AY1 (DD12_AY1.22), AY2 (DD12_AY2.22), AY3 (DD12_AY3.22), system_bus (DD1.5 DR1.5), address_detector (DD4.5), future_connector (P2.34)
AD7: AY1 (DD12_AY1.21), AY2 (DD12_AY2.21), AY3 (DD12_AY3.21), system_bus (DD1.6 DR1.6), address_detector (DD4.6), future_connector (P2.32)
AD8: system_bus (DD1.3 DR1.3), address_detector (DD4.3), future_connector (P2.38)
AD9: system_bus (DD1.4 DR1.4), address_detector (DD4.4), future_connector (P2.36)
AD10: system_bus (DD3.9 DR2.9), address_detector (DD10.9), future_connector (P2.42)
AD11: system_bus (DD1.2 DR1.2), address_detector (DD4.2), future_connector (P2.40)
AD12: system_bus (DD3.3 DR2.3), address_detector (DD10.3), future_connector (P2.54)
AD13: system_bus (DD3.4 DR2.4), future_connector (P2.52)
AD14: system_bus (DD3.2 DR2.2), future_connector (P2.56)
AD15: system_bus (DD1.9 DR1.9), future_connector (P2.26)
~{BS7}: address_detector (DD4.12 DD6.1), future_connector (P2.25)
BC1: AY1 (DD12_AY1.20), AY2 (DD12_AY2.20), AY3 (DD12_AY3.20), address_detector (DD7.8)
BDIR: AY1 (DD12_AY1.18), AY2 (DD12_AY2.18), AY3 (DD12_AY3.18), address_detector (DD7.6)
Beeper: mixer (R15.2), system_bus (P1.B5)
~{CE}0: system_bus (P1.B12), future_connector (P2.5)
~{CE}1: system_bus (P1.B14), future_connector (P2.11)
~{CE}2: system_bus (P1.B13), future_connector (P2.7)
~{CE}3: system_bus (P1.A12), future_connector (P2.9)
~{CS}1: address_detector (DD5.9), future_connector (P2.18)
~{CS}2: address_detector (DD5.14), future_connector (P2.15)
~{CS}3: address_detector (DD5.10), future_connector (P2.16)
~{CS}4: address_detector (DD5.12), future_connector (P2.17)
~{CS}5: address_detector (DD5.7), future_connector (P2.22)
CLK: AY1 (DD12_AY1.15), AY2 (DD12_AY2.15), AY3 (DD12_AY3.15), address_detector (DD11#2.5)
CS: AY1 (DD12_AY1.17), address_detector (DD8.8 R2.2)
CS: AY2 (DD12_AY2.17), address_detector (DD6.8)
CS: AY3 (DD12_AY3.17), address_detector (DD6.6)
~{DIN}: system_bus (DD2.2), address_detector (5 pins), future_connector (P2.6)
~{DOUT}: system_bus (DD2.4), address_detector (DD8.5), future_connector (P2.4)
e~{BS7}: system_bus (P1.A6), address_detector (DD4.9)
~{INIT}: AY1 (DD12_AY1.16), AY2 (DD12_AY2.16), AY3 (DD12_AY3.16), system_bus (DD2.10), future_connector (P2.14)
L_IN1: AY1 (R4_AY1.1 R5_AY1.1), AY2 (R4_AY2.1 R5_AY2.1), AY3 (R4_AY3.1 R5_AY3.1), mixer (C28.1 R11.1)
~{RPLY}: system_bus (P1.B15), address_detector (DD8.3), future_connector (P2.19)
R_IN1: AY1 (R6_AY1.1 R7_AY1.1), AY2 (R6_AY2.1 R7_AY2.1), AY3 (R6_AY3.1 R7_AY3.1), mixer (C37.1 R23.1)
~{SYNC}: system_bus (DD2.12), address_detector (C14.2 DD4.11 DD5.4 DD10.11), future_connector (P2.20)
T/~{R}: system_bus (DD1.1 DD3.1), address_detector (DD7.11)
~{WTBT}: system_bus (DD2.6), address_detector (DD7.10), future_connector (P2.13)